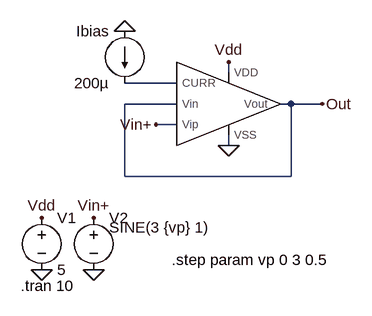
[diagram p0: schematic voltage_follower.asc]
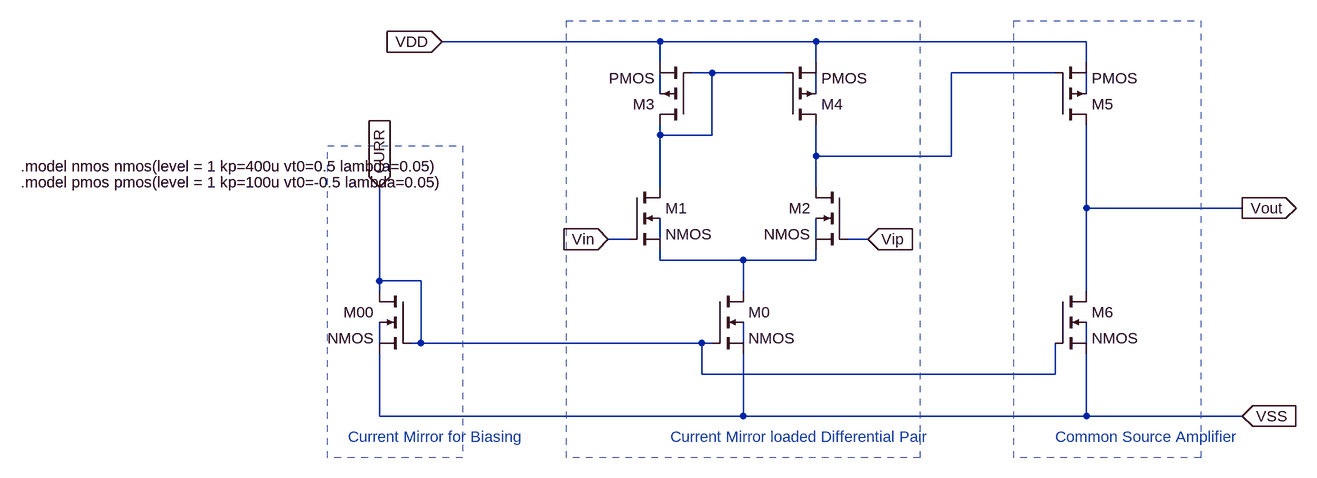
[diagram p1: sub-circuit 2stage_opamp_design.asc]
voltage_follower.asc, the LTspice schematic file:
Version 4
SHEET 1 880 680
WIRE 320 -16 320 -32
WIRE 240 0 160 0
WIRE 240 32 160 32
WIRE 416 32 400 32
WIRE 464 32 416 32
WIRE 240 64 208 64
WIRE 320 96 320 80
WIRE 160 144 160 32
WIRE 416 144 416 32
WIRE 416 144 160 144
FLAG 32 288 0
FLAG 112 288 0
FLAG 32 208 Vdd
FLAG 320 -32 Vdd
FLAG 112 208 Vin+
FLAG 208 64 Vin+
FLAG 464 32 Out
FLAG 320 96 0
FLAG 160 -80 0
SYMBOL voltage 32 192 R0
WINDOW 123 0 0 Left 0
WINDOW 39 0 0 Left 0
SYMATTR InstName V1
SYMATTR Value 5
SYMBOL voltage 112 192 R0
WINDOW 3 24 30 Left 2
WINDOW 123 0 0 Left 0
WINDOW 39 0 0 Left 0
SYMATTR Value SINE(3 {vp} 1)
SYMATTR InstName V2
SYMBOL 2stage_opamp_design 320 32 R0
WINDOW 0 0 -88 Invisible 2
SYMATTR InstName X2
SYMBOL current 160 -80 M0
WINDOW 123 0 0 Left 0
WINDOW 39 0 0 Left 0
SYMATTR InstName Ibias
SYMATTR Value 200µ
TEXT 0 312 Left 2 !.tran 10
TEXT 232 272 Left 2 !.step param vp 0 3 0.5

2stage_opamp_design.asc, the sub-circuit schematic file:
Version 4
SHEET 1 1084 680
WIRE 128 16 -208 16
WIRE 368 16 128 16
WIRE 784 16 368 16
WIRE 128 48 128 16
WIRE 368 48 368 16
WIRE 784 48 784 16
WIRE 208 64 176 64
WIRE 320 64 208 64
WIRE 736 64 576 64
WIRE 128 96 128 64
WIRE 368 96 368 64
WIRE 784 96 784 64
WIRE 128 160 128 144
WIRE 208 160 208 64
WIRE 208 160 128 160
WIRE 368 192 368 144
WIRE 576 192 576 64
WIRE 576 192 368 192
WIRE 128 240 128 160
WIRE 368 240 368 192
WIRE 784 272 784 144
WIRE 1024 272 784 272
WIRE 80 320 48 320
WIRE 128 320 128 288
WIRE 368 320 368 288
WIRE 448 320 416 320
WIRE 128 352 128 336
WIRE 256 352 128 352
WIRE 368 352 368 336
WIRE 368 352 256 352
WIRE -304 384 -304 240
WIRE -240 384 -304 384
WIRE -304 400 -304 384
WIRE 256 400 256 352
WIRE 784 400 784 272
WIRE -304 480 -304 448
WIRE -240 480 -240 384
WIRE -240 480 -256 480
WIRE 192 480 -240 480
WIRE 208 480 192 480
WIRE 256 480 256 448
WIRE 784 480 784 448
WIRE 192 528 192 480
WIRE 736 528 736 480
WIRE 736 528 192 528
WIRE -304 592 -304 496
WIRE 256 592 256 496
WIRE 256 592 -304 592
WIRE 784 592 784 496
WIRE 784 592 256 592
WIRE 1024 592 784 592
FLAG -208 16 VDD
IOPIN -208 16 In
FLAG 48 320 Vin
IOPIN 48 320 In
FLAG 448 320 Vip
IOPIN 448 320 In
FLAG 1024 272 Vout
IOPIN 1024 272 Out
FLAG -304 240 CURR
IOPIN -304 240 In
FLAG 1024 592 VSS
IOPIN 1024 592 In
SYMBOL nmos4 -256 400 M0
SYMATTR InstName M00
SYMATTR Value2 l=1 w=4
SYMBOL pmos4 176 144 R180
SYMATTR InstName M3
SYMATTR Value2 l=1 w=64
SYMBOL pmos4 320 144 M180
SYMATTR InstName M4
SYMATTR Value2 l=1 w=64
SYMBOL nmos4 208 400 R0
SYMATTR InstName M0
SYMATTR Value2 l=1 w=32
SYMBOL nmos4 80 240 R0
SYMATTR InstName M1
SYMATTR Value2 l=1 w=16
SYMBOL nmos4 416 240 M0
SYMATTR InstName M2
SYMATTR Value2 l=1 w=16
SYMBOL nmos4 736 400 R0
SYMATTR InstName M6
SYMATTR Value2 l=1 w=160
SYMBOL pmos4 736 144 M180
SYMATTR InstName M5
SYMATTR Value2 l=1 w=640
TEXT -856 208 Left 2 !.model nmos nmos(level = 1 kp=400u vt0=0.5 lambda=0.05)
TEXT -856 232 Left 2 !.model pmos pmos(level = 1 kp=100u vt0=-0.5 lambda=0.05)
TEXT -352 624 Left 2 ;Current Mirror for Biasing
TEXT 144 624 Left 2 ;Current Mirror loaded Differential Pair
TEXT 736 624 Left 2 ;Common Source Amplifier
RECTANGLE Normal -176 656 -384 176 2
RECTANGLE Normal 528 656 -16 -16 2
RECTANGLE Normal 960 656 672 -16 2

The netlist it stands for:
* voltage_follower.asc
V1 Vdd 0 5
V2 Vin+ 0 SINE(3 {vp} 1)
XX2 N001 Vdd Out Vin+ 0 Out 2stage_opamp_design
Ibias 0 N001 200µ

* block symbol definitions
.subckt 2stage_opamp_design CURR VDD Vin Vip VSS Vout
M00 CURR CURR VSS N009 NMOS l=1 w=4
M3 N001 N001 VDD N003 PMOS l=1 w=64
M4 N002 N001 VDD N004 PMOS l=1 w=64
M0 N008 CURR VSS N010 NMOS l=1 w=32
M1 N001 Vin N008 N006 NMOS l=1 w=16
M2 N002 Vip N008 N007 NMOS l=1 w=16
M6 Vout CURR VSS N011 NMOS l=1 w=160
M5 Vout N002 VDD N005 PMOS l=1 w=640
.model nmos nmos(level = 1 kp=400u vt0=0.5 lambda=0.05)
.model pmos pmos(level = 1 kp=100u vt0=-0.5 lambda=0.05)
* Current Mirror for Biasing
* Current Mirror loaded Differential Pair
* Common Source Amplifier
.ends 2stage_opamp_design

.model NMOS NMOS
.model PMOS PMOS
.lib standard.mos
.tran 10
.step param vp 0 3 0.5
.backanno
.end